# Altium project FPGA_breakout_board.PrjPcb
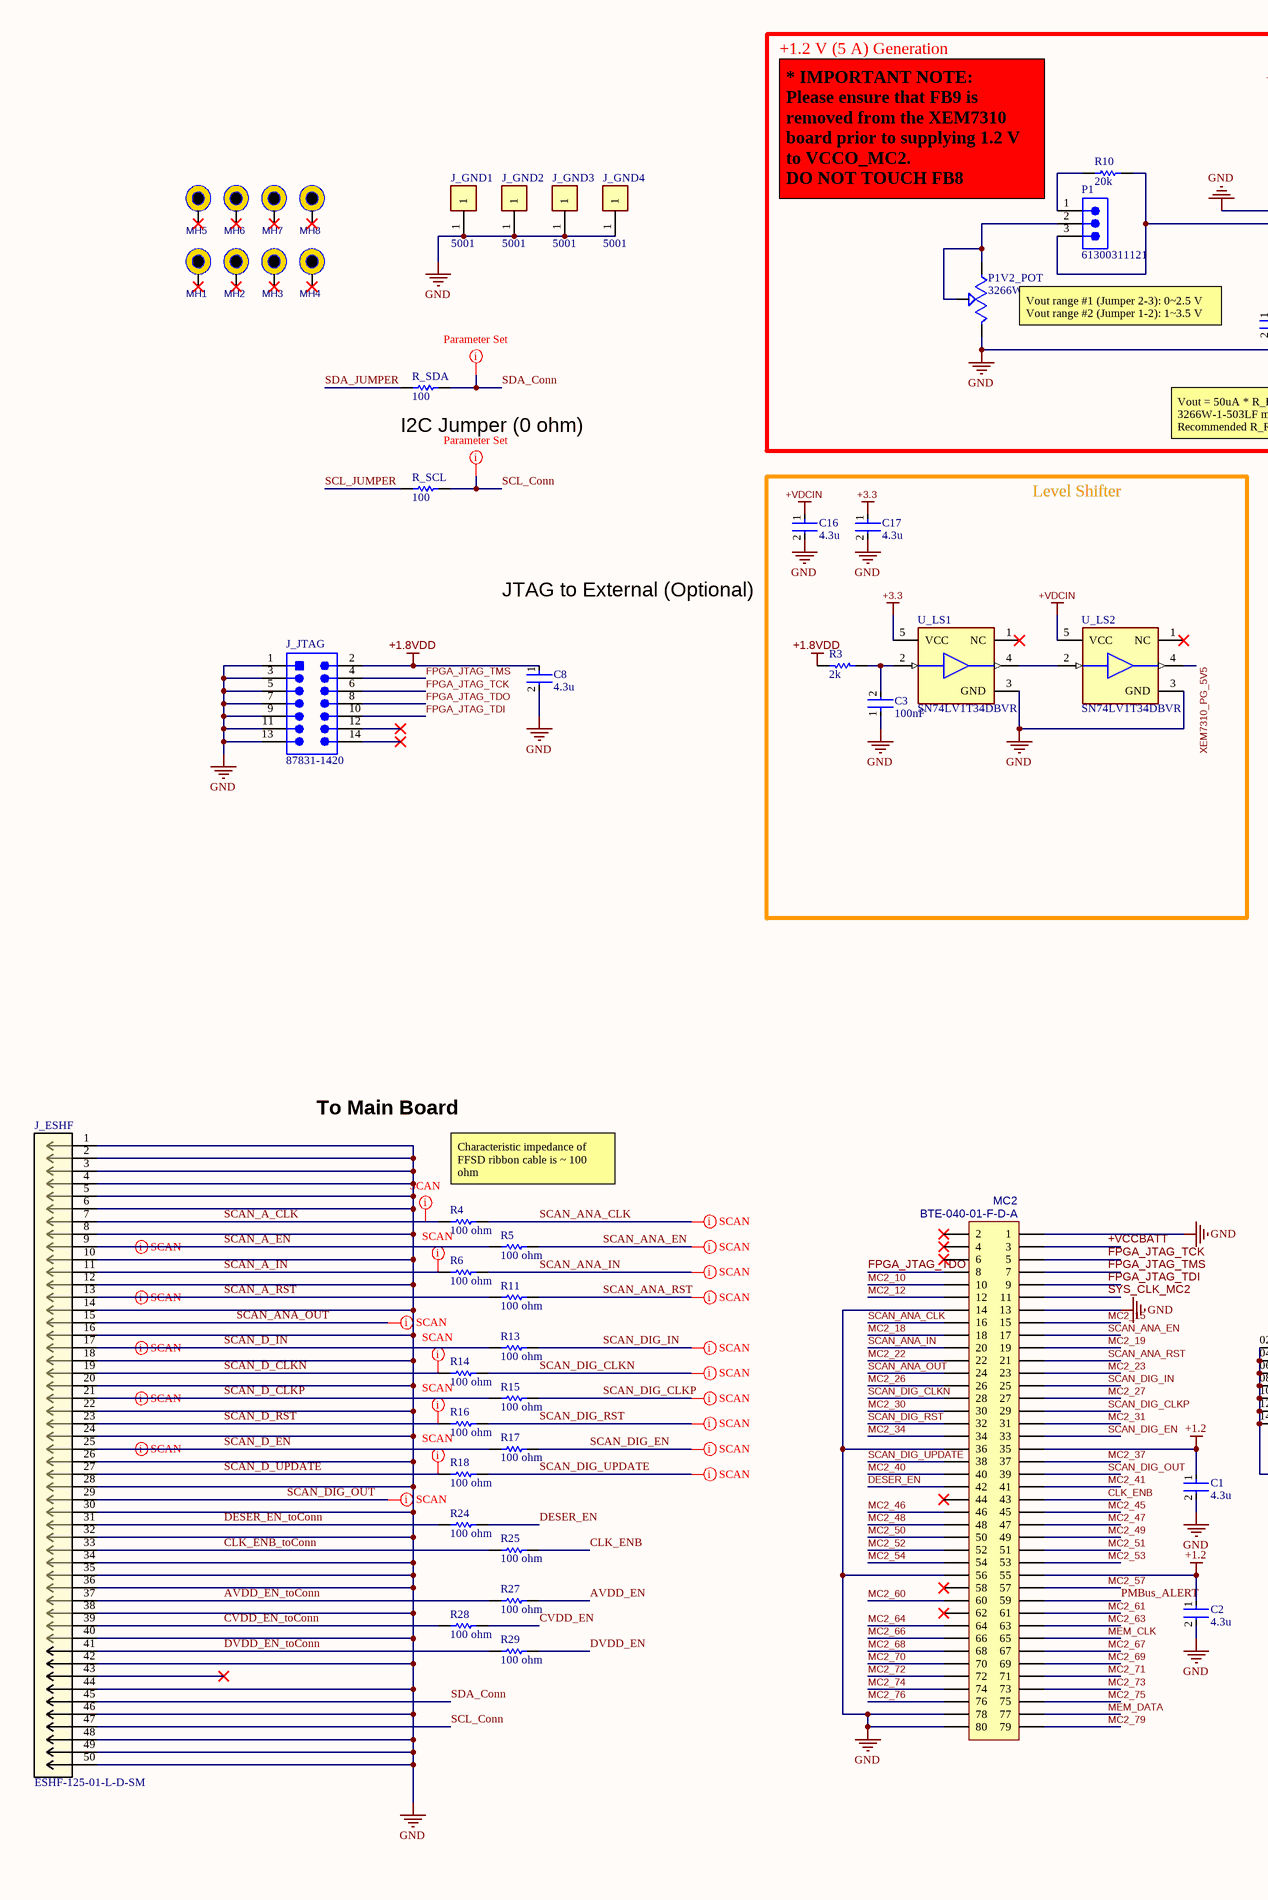
[diagram p0: BoardTop.SchDoc, left]
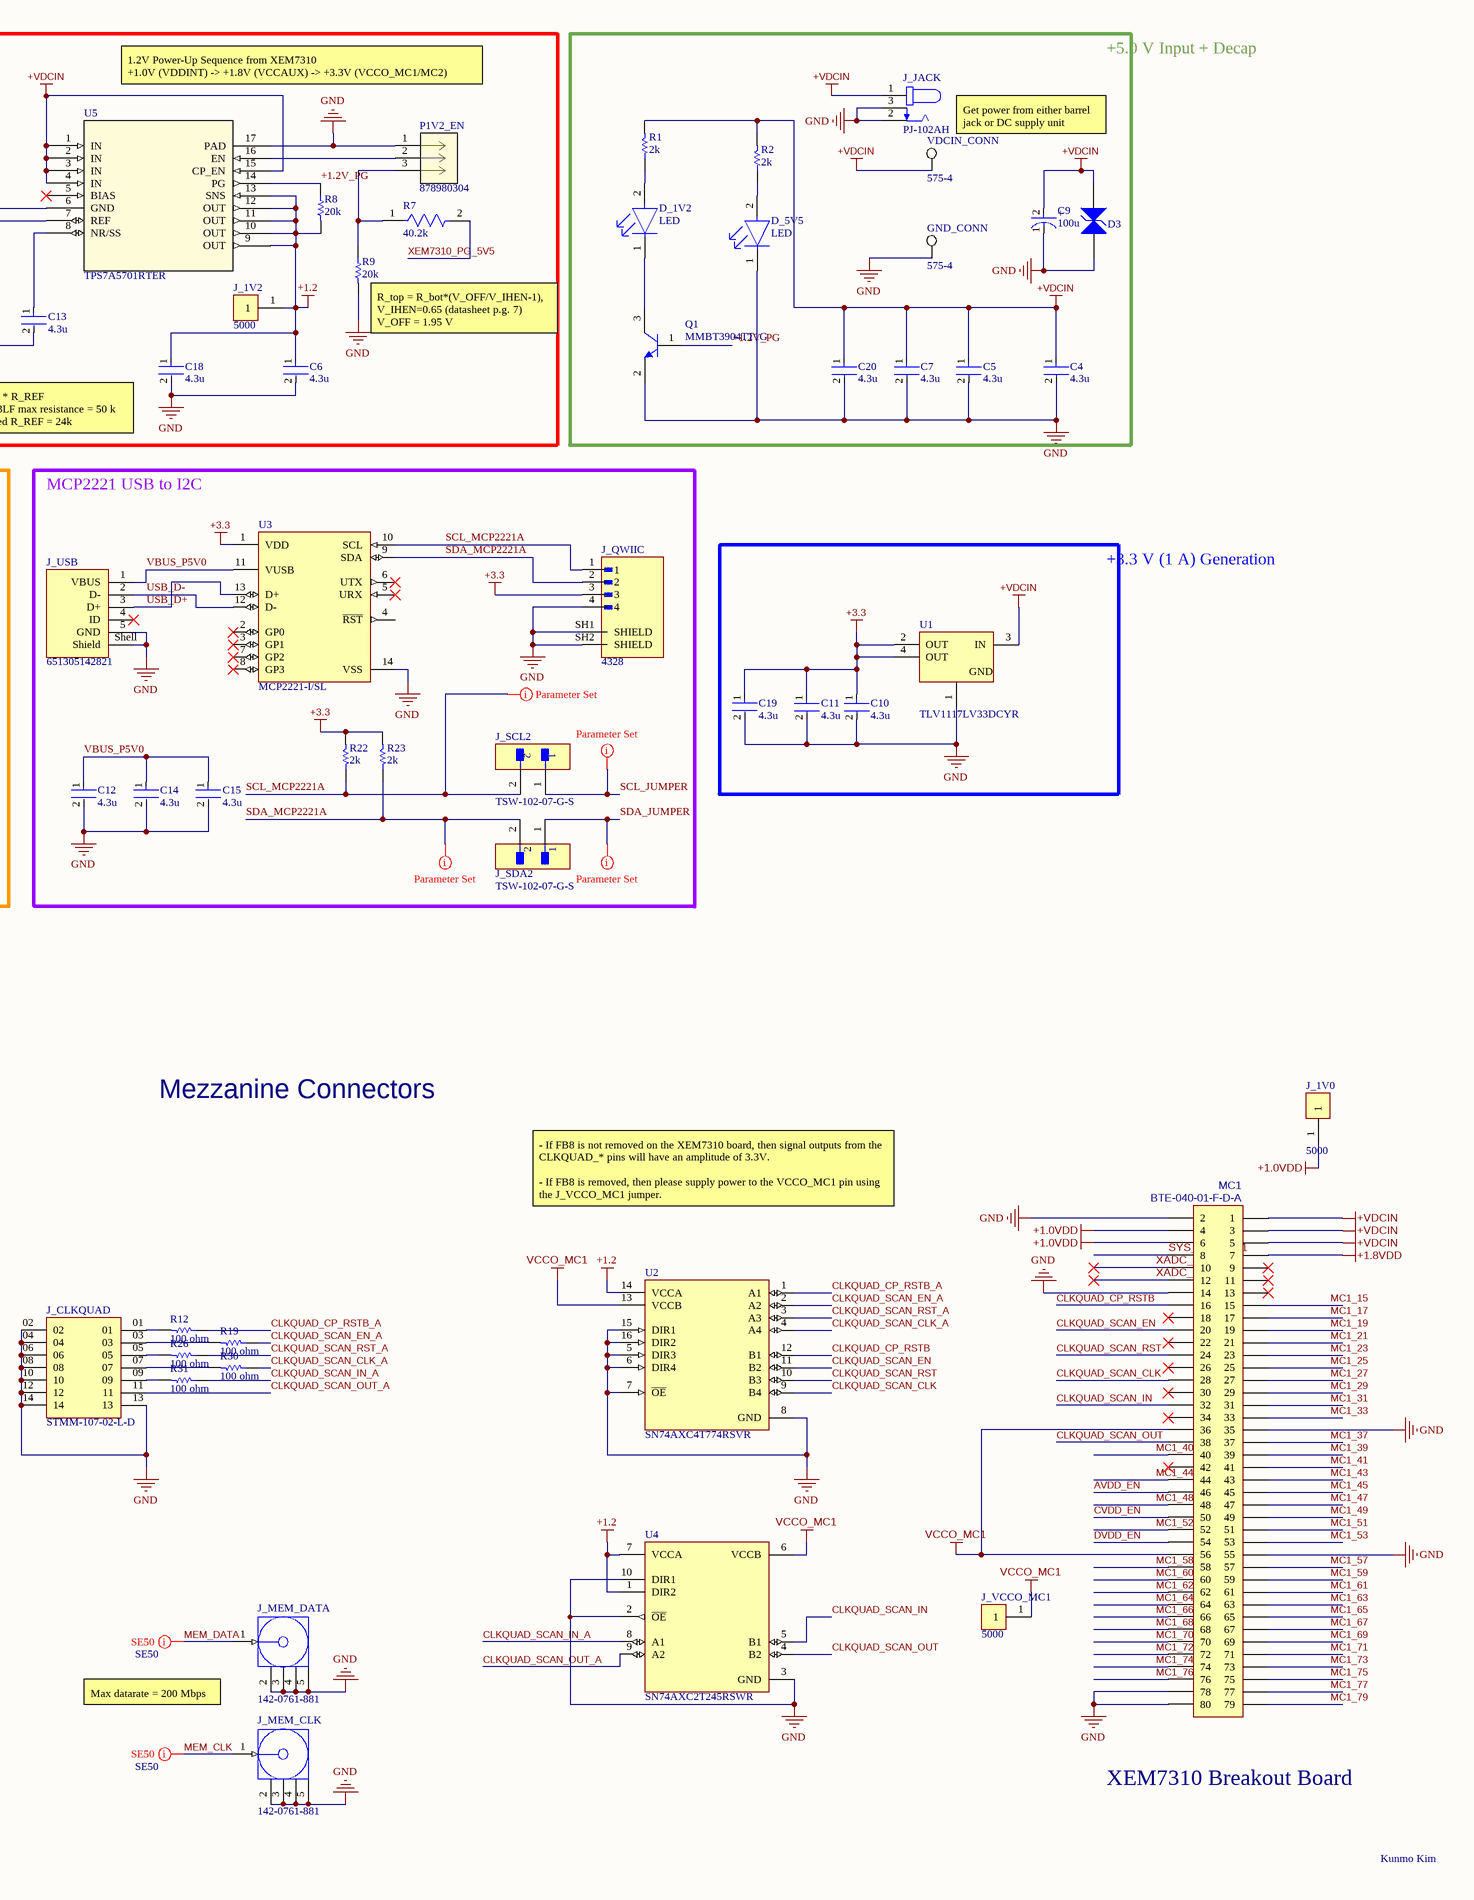
[diagram p1: BoardTop.SchDoc, right]
1 sheet, 94 parts. Net scope: global (net labels, ports and power ports of the same name join across sheets).
Board file: FPGA_breakout_board_v1.PcbDoc

## Sheet BoardTop.SchDoc
size A2; SheetNumber: 1; SheetTotal: 1

### Parts
C1  4.3u  [FP-LLL1U4-0_05-IPC_C]
C2  4.3u  [FP-LLL1U4-0_05-IPC_C]
C3  100nF  [FP-0603-L_1_6_0_15-W_0_81-MFG]
C4  4.3u  [FP-LLL1U4-0_05-IPC_C]
C5  4.3u  [FP-LLL1U4-0_05-IPC_C]
C6  4.3u  [FP-LLL1U4-0_05-IPC_C]
C7  4.3u  [FP-LLL1U4-0_05-IPC_C]
C8  4.3u  [FP-LLL1U4-0_05-IPC_C]
C9  100u  [FP-CX-MFG]
C10  4.3u  [FP-LLL1U4-0_05-IPC_C]
C11  4.3u  [FP-LLL1U4-0_05-IPC_C]
C12  4.3u  [FP-LLL1U4-0_05-IPC_C]
C13  4.3u  [FP-LLL1U4-0_05-IPC_C]
C14  4.3u  [FP-LLL1U4-0_05-IPC_C]
C15  4.3u  [FP-LLL1U4-0_05-IPC_C]
C16  4.3u  [FP-LLL1U4-0_05-IPC_C]
C17  4.3u  [FP-LLL1U4-0_05-IPC_C]
C18  4.3u  [FP-LLL1U4-0_05-IPC_C]
C19  4.3u  [FP-LLL1U4-0_05-IPC_C]
C20  4.3u  [FP-LLL1U4-0_05-IPC_C]
D3  SMAJ6.0CAHE3/5A  [VISH-DO-214AC-2_L]  (value not drawn)
D_1V2  LED  [FP-LTST-C190KGKT-MFG]
D_5V5  LED  [FP-LTST-C190KGKT-MFG]
GND_CONN  575-4  [KSTN-575-4]
J_1V0  5000  [FP-5000-MFG]
J_1V2  5000  [FP-5000-MFG]
J_CLKQUAD  STMM-107-02-L-D  [SAMTEC_STMM-107-02-L-D]
J_ESHF  ESHF-125-01-L-D-SM  [CONN_ESHF-125-01-x-D-SM_SAI]
J_GND1  5001  [FP-5001-MFG]
J_GND2  5001  [FP-5001-MFG]
J_GND3  5001  [FP-5001-MFG]
J_GND4  5001  [FP-5001-MFG]
J_JACK  PJ-102AH  [CUI_PJ-102AH]
J_JTAG  87831-1420  [MOLEX-87831-1420_V]
J_MEM_CLK  142-0761-881  [EMSN-142-0761-881-5_V]
J_MEM_DATA  142-0761-881  [EMSN-142-0761-881-5_V]
J_QWIIC  4328  [ADAFRUIT_4328]
J_SCL2  TSW-102-07-G-S  [FP-TSW-102-07-G-S-MFG]
J_SDA2  TSW-102-07-G-S  [FP-TSW-102-07-G-S-MFG]
J_USB  651305142821  [651305142821]
J_VCCO_MC1  5000  [FP-5000-MFG]
MC1  BTE-040-01-F-D-A  [BTE-040]
MC2  BTE-040-01-F-D-A  [BTE-040]
MH1  MTG  [MTG-3.2/6.5-PTH]  (value not drawn)
MH2  MTG  [MTG-3.2/6.5-PTH]  (value not drawn)
MH3  MTG  [MTG-3.2/6.5-PTH]  (value not drawn)
MH4  MTG  [MTG-3.2/6.5-PTH]  (value not drawn)
MH5  MTG  [MTG-3.2/6.5-PTH]  (value not drawn)
MH6  MTG  [MTG-3.2/6.5-PTH]  (value not drawn)
MH7  MTG  [MTG-3.2/6.5-PTH]  (value not drawn)
MH8  MTG  [MTG-3.2/6.5-PTH]  (value not drawn)
P1  61300311121  [61300311121]
P1V2_EN  878980304  [CONN03_87898_M-5p84_MOL]
P1V2_POT  3266W-1-503LF  [TRIM_3266W-1-503LF]
Q1  MMBT3904TT1G  [ONSC-SC-75-3-463-01_V]
R1  2k  [RESC3216X70X50NL05T20]
R2  2k  [RESC3216X70X50NL05T20]
R3  2k  [RESC3216X70X50NL05T20]
R4  100 ohm  [RESC1005X40X25ML05T05]
R5  100 ohm  [RESC1005X40X25ML05T05]
R6  100 ohm  [RESC1005X40X25ML05T05]
R7  40.2k  [FP-ERJ3EK-IPC_C]
R8  20k  [RESC1608X55X30ML15T15]
R9  20k  [RESC1608X55X30ML15T15]
R10  20k  [RESC1608X55X30ML15T15]
R11  100 ohm  [RESC1005X40X25ML05T05]
R12  100 ohm  [RESC1005X40X25ML05T05]
R13  100 ohm  [RESC1005X40X25ML05T05]
R14  100 ohm  [RESC1005X40X25ML05T05]
R15  100 ohm  [RESC1005X40X25ML05T05]
R16  100 ohm  [RESC1005X40X25ML05T05]
R17  100 ohm  [RESC1005X40X25ML05T05]
R18  100 ohm  [RESC1005X40X25ML05T05]
R19  100 ohm  [RESC1005X40X25ML05T05]
R22  2k  [RESC3216X70X50NL05T20]
R23  2k  [RESC3216X70X50NL05T20]
R24  100 ohm  [RESC1005X40X25ML05T05]
R25  100 ohm  [RESC1005X40X25ML05T05]
R26  100 ohm  [RESC1005X40X25ML05T05]
R27  100 ohm  [RESC1005X40X25ML05T05]
R28  100 ohm  [RESC1005X40X25ML05T05]
R29  100 ohm  [RESC1005X40X25ML05T05]
R30  100 ohm  [RESC1005X40X25ML05T05]
R31  100 ohm  [RESC1005X40X25ML05T05]
R_SCL  100  [RESC1608X55X30LL15T15]
R_SDA  100  [RESC1608X55X30LL15T15]
U1  TLV1117LV33DCYR  [DCY0004A_N]
U2  SN74AXC4T774RSVR  [FP-RSV0016A-MFG]
U3  MCP2221-I/SL  [FP-C04-065-SL-IPC_A]
U4  SN74AXC2T245RSWR  [FP-RSW0010A-MFG]
U5  TPS7A5701RTER  [WQFN16_RTE_TEX]
U_LS1  SN74LV1T34DBVR  [FP-DBV0005A-MFG]
U_LS2  SN74LV1T34DBVR  [FP-DBV0005A-MFG]
VDCIN_CONN  575-4  [KSTN-575-4]

### Blocks framed on the sheet
+1.2 V (5 A) Generation: C6 C13 C18 J_1V2 P1 P1V2_EN P1V2_POT R7-R10 U5
+5.0 V Input + Decap: C4 C5 C7 C9 C20 D3 D_1V2 D_5V5 GND_CONN J_JACK Q1 R1 R2 VDCIN_CONN
Level Shifter: C3 C16 C17 R3 U_LS1 U_LS2
MCP2221 USB to I2C: C12 C14 C15 J_QWIIC J_SCL2 J_SDA2 J_USB R22 R23 U3
+3.3 V (1 A) Generation: C10 C11 C19 U1

### Nets
+1.0VDD: J_1V0.1 MC1.4 MC1.6
+1.2: C1.1 C2.1 C6.1 C18.1 J_1V2.1 MC2.35 MC2.55 R8.2 U2.14(VCCA) U4.1(DIR2) U4.7(VCCA) U5.9(OUT) U5.10(OUT) U5.11(OUT) U5.12(OUT) U5.13(SNS)
+1.8VDD: C8.1 J_JTAG.2 MC1.7 R3.2
+3.3: C10.1 C11.1 C17.1 C19.1 J_QWIIC.3 R22.2 R23.2 U1.2(OUT) U1.4(OUT) U3.1(VDD) U_LS1.5(VCC)
+VDCIN: C4.1 C5.1 C7.1 C9.2(A) C16.1 C20.1 D3.1(A1) J_JACK.1 MC1.1 MC1.3 MC1.5 R1.2 R2.2 U1.3(IN) U5.1(IN) U5.2(IN) U5.3(IN) U5.4(IN) U5.15(CP_EN) U_LS2.5(VCC) VDCIN_CONN.1
GND: C1.2 C2.2 C3.1 C4.2 C5.2 C6.2 C7.2 C8.2 C9.1(C) C10.2 C11.2 C12.2 C13.2 C14.2 C15.2 C16.2 C17.2 C18.2 C19.2 C20.2 D3.2(A2) D_5V5.1(C) GND_CONN.1 J_CLKQUAD.02 J_CLKQUAD.04 J_CLKQUAD.06 J_CLKQUAD.08 J_CLKQUAD.10 J_CLKQUAD.12 J_CLKQUAD.13 J_CLKQUAD.14 J_ESHF.1 J_ESHF.2 J_ESHF.3 J_ESHF.4 J_ESHF.5 J_ESHF.6 J_ESHF.8 J_ESHF.10 J_ESHF.12 J_ESHF.14 J_ESHF.16 J_ESHF.18 J_ESHF.20 J_ESHF.22 J_ESHF.24 J_ESHF.26 J_ESHF.28 J_ESHF.30 J_ESHF.32 J_ESHF.34 J_ESHF.35 J_ESHF.36 J_ESHF.38 J_ESHF.40 J_ESHF.42 J_ESHF.44 J_ESHF.46 J_ESHF.48 J_ESHF.49 J_ESHF.50 J_GND1.1 J_GND2.1 J_GND3.1 J_GND4.1 J_JACK.2 J_JACK.3 J_JTAG.1 J_JTAG.3 J_JTAG.5 J_JTAG.7 J_JTAG.9 J_JTAG.11 J_JTAG.13 J_MEM_CLK.2(GND) J_MEM_CLK.3(GND) J_MEM_CLK.4(GND) J_MEM_CLK.5(GND) J_MEM_DATA.2(GND) J_MEM_DATA.3(GND) J_MEM_DATA.4(GND) J_MEM_DATA.5(GND) J_QWIIC.4 J_QWIIC.SH1(SHIELD) J_QWIIC.SH2(SHIELD) J_USB.5(GND) J_USB.Shell(Shield) MC1.2 MC1.14 MC1.35 MC1.55 MC1.78 MC1.80 MC2.1 MC2.13 MC2.14 MC2.36 MC2.56 MC2.78 MC2.80 P1V2_EN.1 P1V2_POT.3(CW) Q1.2(E) R9.2 U1.1(GND) U2.5(DIR3) U2.6(DIR4) U2.7(~{OE}) U2.8(GND) U2.15(DIR1) U2.16(DIR2) U3.14(VSS) U4.2(~{OE}) U4.3(GND) U4.10(DIR1) U5.6(GND) U5.17(PAD) U_LS1.3(GND) U_LS2.3(GND)
VCCO_MC1: J_VCCO_MC1.1 MC1.36 MC1.56 U2.13(VCCB) U4.6(VCCB)
+1.2V_PG: Q1.1(B) R8.1 U5.14(PG)
+VCCBATT: MC2.3
AVDD_EN: MC1.46 R27.2
AVDD_EN_toConn: J_ESHF.37 R27.1
CLK_ENB: MC2.43 R25.2
CLK_ENB_toConn: J_ESHF.33 R25.1
CLKQUAD_CP_RSTB: MC1.16 U2.12(B1)
CLKQUAD_CP_RSTB_A: R12.1 U2.1(A1)
CLKQUAD_SCAN_CLK: MC1.28 U2.9(B4)
CLKQUAD_SCAN_CLK_A: R30.1 U2.4(A4)
CLKQUAD_SCAN_EN: MC1.20 U2.11(B2)
CLKQUAD_SCAN_EN_A: R19.1 U2.2(A2)
CLKQUAD_SCAN_IN: MC1.32 U4.5(B1)
CLKQUAD_SCAN_IN_A: R31.1 U4.8(A1)
CLKQUAD_SCAN_OUT: MC1.38 U4.4(B2)
CLKQUAD_SCAN_OUT_A: J_CLKQUAD.11 U4.9(A2)
CLKQUAD_SCAN_RST: MC1.24 U2.10(B3)
CLKQUAD_SCAN_RST_A: R26.1 U2.3(A3)
CVDD_EN: MC1.50 R28.2
CVDD_EN_toConn: J_ESHF.39 R28.1
DESER_EN: MC2.42 R24.2
DESER_EN_toConn: J_ESHF.31 R24.1
DVDD_EN: MC1.54 R29.2
DVDD_EN_toConn: J_ESHF.41 R29.1
FPGA_JTAG_TCK: J_JTAG.6 MC2.5
FPGA_JTAG_TDI: J_JTAG.10 MC2.9
FPGA_JTAG_TDO: J_JTAG.8 MC2.8
FPGA_JTAG_TMS: J_JTAG.4 MC2.7
MC1_15: MC1.15
MC1_17: MC1.17
MC1_19: MC1.19
MC1_21: MC1.21
MC1_23: MC1.23
MC1_25: MC1.25
MC1_27: MC1.27
MC1_29: MC1.29
MC1_31: MC1.31
MC1_33: MC1.33
MC1_37: MC1.37
MC1_39: MC1.39
MC1_40: MC1.40
MC1_41: MC1.41
MC1_43: MC1.43
MC1_44: MC1.44
MC1_45: MC1.45
MC1_47: MC1.47
MC1_48: MC1.48
MC1_49: MC1.49
MC1_51: MC1.51
MC1_52: MC1.52
MC1_53: MC1.53
MC1_57: MC1.57
MC1_58: MC1.58
MC1_59: MC1.59
MC1_60: MC1.60
MC1_61: MC1.61
MC1_62: MC1.62
MC1_63: MC1.63
MC1_64: MC1.64
MC1_65: MC1.65
MC1_66: MC1.66
MC1_67: MC1.67
MC1_68: MC1.68
MC1_69: MC1.69
MC1_70: MC1.70
MC1_71: MC1.71
MC1_72: MC1.72
MC1_73: MC1.73
MC1_74: MC1.74
MC1_75: MC1.75
MC1_76: MC1.76
MC1_77: MC1.77
MC1_79: MC1.79
MC2_10: MC2.10
MC2_12: MC2.12
MC2_15: MC2.15
MC2_18: MC2.18
MC2_19: MC2.19
MC2_22: MC2.22
MC2_23: MC2.23
MC2_26: MC2.26
MC2_27: MC2.27
MC2_30: MC2.30
MC2_31: MC2.31
MC2_34: MC2.34
MC2_37: MC2.37
MC2_40: MC2.40
MC2_41: MC2.41
MC2_45: MC2.45
MC2_46: MC2.46
MC2_47: MC2.47
MC2_48: MC2.48
MC2_49: MC2.49
MC2_50: MC2.50
MC2_51: MC2.51
MC2_52: MC2.52
MC2_53: MC2.53
MC2_54: MC2.54
MC2_57: MC2.57
MC2_60: MC2.60
MC2_61: MC2.61
MC2_63: MC2.63
MC2_64: MC2.64
MC2_66: MC2.66
MC2_67: MC2.67
MC2_68: MC2.68
MC2_69: MC2.69
MC2_70: MC2.70
MC2_71: MC2.71
MC2_72: MC2.72
MC2_73: MC2.73
MC2_74: MC2.74
MC2_75: MC2.75
MC2_76: MC2.76
MC2_79: MC2.79
MEM_CLK: J_MEM_CLK.1(Signal) MC2.65
MEM_DATA: J_MEM_DATA.1(Signal) MC2.77
PMBus_ALERT: MC2.59
SCAN_A_CLK: J_ESHF.7 R4.1
SCAN_A_EN: J_ESHF.9 R5.1
SCAN_A_IN: J_ESHF.11 R6.1
SCAN_A_RST: J_ESHF.13 R11.1
SCAN_ANA_CLK: MC2.16 R4.2
SCAN_ANA_EN: MC2.17 R5.2
SCAN_ANA_IN: MC2.20 R6.2
SCAN_ANA_OUT: J_ESHF.15 MC2.24
SCAN_ANA_RST: MC2.21 R11.2
SCAN_D_CLKN: J_ESHF.19 R14.1
SCAN_D_CLKP: J_ESHF.21 R15.1
SCAN_D_EN: J_ESHF.25 R17.1
SCAN_D_IN: J_ESHF.17 R13.1
SCAN_D_RST: J_ESHF.23 R16.1
SCAN_D_UPDATE: J_ESHF.27 R18.1
SCAN_DIG_CLKN: MC2.28 R14.2
SCAN_DIG_CLKP: MC2.29 R15.2
SCAN_DIG_EN: MC2.33 R17.2
SCAN_DIG_IN: MC2.25 R13.2
SCAN_DIG_OUT: J_ESHF.29 MC2.39
SCAN_DIG_RST: MC2.32 R16.2
SCAN_DIG_UPDATE: MC2.38 R18.2
SCL_Conn: J_ESHF.47 R_SCL.2
SCL_JUMPER: J_SCL2.1 R_SCL.1
SCL_MCP2221A: J_QWIIC.1 J_SCL2.2 R22.1 U3.10(SCL)
SDA_Conn: J_ESHF.45 R_SDA.2
SDA_JUMPER: J_SDA2.1 R_SDA.1
SDA_MCP2221A: J_QWIIC.2 J_SDA2.2 R23.1 U3.9(SDA)
SYS_CLK_MC1: MC1.8
SYS_CLK_MC2: MC2.11
USB_D+: J_USB.3(D+) U3.13(D+)
USB_D-: J_USB.2(D-) U3.12(D-)
VBUS_P5V0: C12.1 C14.1 C15.1 J_USB.1(VBUS) U3.11(VUSB)
XADC_VN_FILT: MC1.10
XADC_VP_FILT: MC1.12
XEM7310_PG_5V5: R7.2 U_LS2.4(Y)
NetC3_2: C3.2 R3.1 U_LS1.2(A)
NetC13_1: C13.1 U5.8(NR/SS)
NetD_1V2_1: D_1V2.1(C) Q1.3(C)
NetD_1V2_2: D_1V2.2(A) R1.1
NetD_5V5_2: D_5V5.2(A) R2.1
NetJ_CLKQUAD_01: J_CLKQUAD.01 R12.2
NetJ_CLKQUAD_03: J_CLKQUAD.03 R19.2
NetJ_CLKQUAD_05: J_CLKQUAD.05 R26.2
NetJ_CLKQUAD_07: J_CLKQUAD.07 R30.2
NetJ_CLKQUAD_09: J_CLKQUAD.09 R31.2
NetP1_1: P1.1 R10.1
NetP1_2: P1.2 P1V2_POT.1(CCW) P1V2_POT.2(WIPER)
NetP1_3: P1.3 R10.2 U5.7(REF)
NetP1V2_EN_2: P1V2_EN.2 U5.16(EN)
NetP1V2_EN_3: P1V2_EN.3 R7.1 R9.1
NetU_LS1_4: U_LS1.4(Y) U_LS2.2(A)

Not connected (* = marked no-connect by the designer): J_ESHF 43*; J_JTAG 12* 14*; J_USB 4(ID)*; MC1 9* 11* 13* 18* 22* 26* 30* 34* 42*; MC2 2* 4* 6* 44* 58* 62*; MH1 1*; MH2 1*; MH3 1*; MH4 1*; MH5 1*; MH6 1*; MH7 1*; MH8 1*; U3 2(GP0)* 3(GP1)* 4(~{RST}) 5(URX)* 6(UTX)* 7(GP2)* 8(GP3)*; U5 5(BIAS)*; U_LS1 1(NC)*; U_LS2 1(NC)*

### Layout directives
net class SE50: MEM_CLK, MEM_DATA
net class SCAN: SCAN_A_CLK, SCAN_A_EN, SCAN_A_IN, SCAN_A_RST, SCAN_ANA_CLK, SCAN_ANA_EN, SCAN_ANA_IN, SCAN_ANA_OUT, SCAN_ANA_RST, SCAN_D_CLKN, SCAN_D_CLKP, SCAN_D_EN, SCAN_D_IN, SCAN_D_RST, SCAN_D_UPDATE, SCAN_DIG_CLKN, SCAN_DIG_CLKP, SCAN_DIG_EN, SCAN_DIG_IN, SCAN_DIG_OUT, SCAN_DIG_RST, SCAN_DIG_UPDATE
net class I2C: SCL_Conn, SCL_JUMPER, SCL_MCP2221A, SDA_Conn, SDA_JUMPER, SDA_MCP2221A

### Notes on the sheet
- 1.2V Power-Up Sequence from XEM7310
  +1.0V (VDDINT) -> +1.8V (VCCAUX) -> +3.3V (VCCO_MC1/MC2)
- Get power from either barrel jack or DC supply unit
- * IMPORTANT NOTE:
  Please ensure that FB9 is removed from the XEM7310 board prior to supplying 1.2 V to VCCO_MC2.
  DO NOT TOUCH FB8
- Vout range #1 (Jumper 2-3): 0~2.5 V
  Vout range #2 (Jumper 1-2): 1~3.5 V
- (near R9) R_top = R_bot*(V_OFF/V_IHEN-1), V_IHEN=0.65 (datasheet p.g. 7)
  V_OFF = 1.95 V
- (near R_SDA) I2C Jumper (0 ohm)
- Vout = 50uA * R_REF
  3266W-1-503LF max resistance = 50 k
  Recommended R_REF = 24k
- JTAG to External (Optional)
- To Main Board
- Mezzanine Connectors
- (near R4) Characteristic impedance of FFSD ribbon cable is ~ 100 ohm
- - If FB8 is not removed on the XEM7310 board, then signal outputs from the CLKQUAD_* pins will have an amplitude of 3.3V.
  - If FB8 is removed, then please supply power to the VCCO_MC1 pin using the J_VCCO_MC1 jumper.
- Max datarate = 200 Mbps
- XEM7310 Breakout Board
- Kunmo Kim
- (in symbol CMP-05427-000056-1) +

### Library data of the parts
C1 C2 C4-C8 C10-C20 = CMP-06035-061933-1: Cap Ceramic Monolithic 4.3uF 20% 4V X5R 15% 02404 (0610M); Capacitance: 4.3uF; Tolerance: 20%; Min Operating Temperature: -55°C; Case/Package: 0204; Voltage Rating: 4V; Mount: Surface Mount; Max Operating Temperature: 85°C; Packaging: Tape and Reel; RoHS Compliant: Yes
C3 = CMP-1035-02592-4: General Purpose Ceramic Capacitor, 0603, 100nF, 10%, X7R, 15%, 50V; Dissipation Factor: 2.5%; Radiation Hardening: No; Termination: SMD/SMT; Tolerance: 10%; Lead Free: Lead Free; Width: 0.81mm; Max Operating Temperature: 125°C; Thickness: 0.035inch; Voltage Rating: 50V; Height: 0.9mm; Case/Package: 0603; Depth: 0.81mm; Number of Pins: 2; Capacitance: 100nF; REACH SVHC: No SVHC; Case Code (Imperial): 0603; Voltage: 50V; Voltage Rating (DC): 50V; Mount: Surface Mount; Length: 1.6mm; Min Operating Temperature: -55°C; Packaging: Tape and Reel; Case Code (Metric): 1608; Dielectric Material: Ceramic; Package Quantity: 1; Dielectric: X7R; Contact Plating: Tin
C9 = CMP-05427-000056-1: CAP ALUM POLY 100UF 20% 6.3V SMD; Leakage Current: 63uA; Polarity: Polar; Lead Diameter: 2.4mm; Dissipation Factor: 0.06%; Ripple Current: 2.7A; ESR (Equivalent Series Resistance): 15mR; Life (Hours): 1000Hour; Voltage Rating: 6.3V; Case/Package: 2917; Lead Pitch: 1.3mm; Series: SP-Cap CX; Weight: 0.004586oz; Radiation Hardening: No; Case Code (Imperial): 2917; Length: 7.3mm; Number of Pins: 2; Lead Free: Lead Free; REACH SVHC: No SVHC; Max Operating Temperature: 105°C; Package Quantity: 3500; Packaging: Tape and Reel; Height - Seated (Max): 0.075inch; Mount: Surface Mount; Height: 1.9mm; Termination: SMD/SMT; Voltage: 6.3V; Construction: Flat; Width: 0.169inch; Ripple Current (AC): 2.7A; Capacitance: 100uF; Voltage Rating (DC): 6.3V; Case Code (Metric): 7343; Min Operating Temperature: -40°C; Tolerance: 20%; RoHS Compliant: Yes; Depth: 4.3mm
D3 = CMP-0548-00108-2: Transient Voltage Suppressor, 6.40 to 231 V, 6 V Stand-off Voltage, Bi-Directional, -55 to 155 degC, 2-pin DO-214AC, Pb-Free, Tape and Reel; Manufacturer: Vishay Semiconductor; VBR Bi-Directional (V): 6.4 to 231; VWM (V): 6; IFSM: 40 A; ID (uA): 1600; PPPM (W): 400, 300; PackageDescription: 2-Pin DO-214AC (SMA), Body 4.245 x 2.665 mm; Packing: Tape and Reel; RoHS: TRUE; ComponentLink3Description: Package Specification; ComponentLink2Description: Datasheet; Mounting Technology: Surface Mount; Operating Junction and Storage Temperature Range: -55 to 150 degC; ComponentLink2URL: http://www.vishay.com/docs/88390/smaj50a.pdf; ComponentLink1Description: Manufacturer URL; DatasheetVersion: 12/8/2013; PackageReference: DO-214AC-2; ComponentLink3URL: http://www.vishay.com/docs/88390/smaj50a.pdf; PartNumber: SMAJ6.0CAHE3/5A; ComponentLink1URL: http://www.vishay.com/; Supplier 1: Mouser; Supplier Part Number 1: 78-SMAJ6.0CAHE3_A/H
D_1V2 D_5V5 = CMP-2000-05197-2: LED GREEN CLEAR CHIP SMD; Test Current: 20mA; Power Rating: 75mW; Forward Voltage: 2V; Wavelength: 574nm; Number of LEDs: 1; Reverse Voltage: 5V; Dominant Wavelength: 571nm; Lens Style: Diffused; Luminous Intensity: 35mcd; Forward Current: 30mA; Viewing Angle: 130°; Lens Color: Colorless; Width: 0.8mm; Case Code (Imperial): 0603; Case Code (Metric): 1608; Number of Pins: 2; Radiation Hardening: No; Package Quantity: 1; Lead Free: Lead Free; Lens Transparency: Clear; Depth: 0.8mm; Power Dissipation: 75mW; Mount: Surface Mount; Max Operating Temperature: 85°C; Case/Package: 0603; Height: 0.8mm; Illumination Color: Green; Color: Green; Length: 1.6mm; Packaging: Tape and Reel; Number of Elements: 1; Min Operating Temperature: -55°C
GND_CONN VDCIN_CONN = CMP-2000-05649-1: Banana Jack, Non-Insulated, 1-Pin THD, RoHS, Bulk; Manufacturer: Keystone-Electronics; Package Version: Rev. B, 11/1994; Plug/Mating Plug Diameter: StandardBanana; Gender: Female; Package Reference: 575-4; Operating Temperature: -; Contact Material: Brass; Packaging: Bulk; Series: -; Category: Connectors,Interconnects; Color: -; Type: BananaJack; Contact Finish: Nickel; Features: -; Family: BananaandTipConnectors-Jacks,Plugs; Body Material: -; Manufacturer URL: http://www.keyelco.com/; Termination: Solder; Insulation: Non-Insulated; Datasheet Version: Rev. B, 11/1994; Mounting Technology: ThroughHole; Package URL: http://www.keyelco.com/product-pdf.cfm?p=2379; Mounting Type: ThroughHole; Package Description: 1-Pin Through Hole Device, Dia 7.92 mm; Datasheet URL: http://www.keyelco.com/product-pdf.cfm?p=2379; Wire Gauge: -; ClassName: InputPowerComponent
J_1V0 J_1V2 J_VCCO_MC1 = CMP-19636-000027-1: PC TEST POINT MINIATURE RED; Outside Diameter: 2.54mm; Body Material: Bronze; Number of Contacts: 1; Insulation: Insulated; Inside Diameter: 1.27mm; Hole Diameter: 1.6mm; Plating: Silver; Length: 7.62mm; Package Quantity: 100; Number of Ports: 1; Contact Material: Bronze; Orientation: Straight; RoHS Compliant: Yes; Housing Color: Red; Height: 0.3inch; Series: THM; Lead Free: Lead Free; Color: Red; Contact Plating: Tin; Mount: PCB; Packaging: Bulk; REACH SVHC: No SVHC; Flammability Rating: UL94 V-0; Material: Nylon
J_CLKQUAD = STMM-107-02-L-D: Connector Header Surface Mount 14 position 0.079 (2.00mm); MF: Samtec; MP: STMM-107-02-L-D; SnapEDA_Link: https://www.snapeda.com/parts/STMM-107-02-L-D/Samtec/view-part/3409678/?ref=snap; Package: None; Value: *; Digi-Key_Part_Number: STMM-107-02-L-D-SM-TR-ND; Supplier 1: Mouser; Supplier Part Number 1: 200-STMM10702LD; Check_prices: https://www.snapeda.com/parts/STMM-107-02-L-D/Samtec/view-part/3409678/?ref=eda; ClassName: InputPowerComponent
J_ESHF = ESHF-125-01-L-D-SM: No Description Available; Mfr_Name: Samtec Inc; Type: Headers, Male Pins; RefDes: RefDes; ClassName: InputPowerComponent; Supplier 1: Digikey; Supplier Part Number 1: SAM15560-ND
J_GND1-J_GND4 = CMP-2000-05181-2: PC TEST POINT MINIATURE BLACK; Body Material: Bronze; Plating: Silver; Inside Diameter: 1.27mm; Hole Diameter: 1.6mm; Number of Ports: 1; Outside Diameter: 2.54mm; Insulation: Insulated; Insulation Material: Nylon; Mount: Through Hole; RoHS Compliant: Yes; Series: THM; Height: 0.3inch; Termination: Through Hole; Material: Nylon; Packaging: Bulk; Contact Material: Bronze; REACH SVHC: No SVHC; Contact Plating: Silver; Orientation: Straight; Lead Free: Lead Free; Package Quantity: 100; Length: 7.62mm; Flammability Rating: UL94 V-0; Number of Contacts: 1; Diameter: 2.54mm; Housing Color: Black; Color: Black
J_JACK = PJ-102AH: 2.0 x 6.5 mm, 5.0 A, Horizontal, Through Hole, Tapered Pins, Dc Power Jack Connector; MF: Same Sky; SnapEDA_Link: https://www.snapeda.com/parts/PJ-102AH/Same+Sky/view-part/?ref=snap; Package: None; Value: *; MP: PJ-102AH; Check_prices: https://www.snapeda.com/parts/PJ-102AH/Same+Sky/view-part/?ref=eda; ClassName: InputPowerComponent
J_JTAG = CMP-2000-05240-1: Header, Pitch 2 mm, 2 x 7 Position, Height 6.4 mm, Tail Length 2.5 mm, -55 to 105 degC, RoHS, Tube; Number of Positions / Contacts: 14; Current Rating: 2A; Brand: Molex; Mounting Angle: Vertical; Pitch: 2mm; Voltage Rating: 125V; Datasheet Version: Rev. E, 04/2006; Housing Material: Thermoplastic; Contact Material: Brass; Datasheet URL: https://datasheet.ciiva.com/27096/1934585-27096088.pdf; Type: Shrouded; Number of Positions: 14; Mounting Style: ThroughHole; Product Category: Headers&WireHousings; RoHS: Details; Factory Pack Quantity: 3200; Contact Plating: Gold; Series: 87831; Number of Rows: 2; Manufacturer: Molex; Product Type: Headers; Termination Style: ThroughHole; Packaging: Tube; Tradename: Milli-Grid; Manufacturer URL: http://www.molex.com/; ClassName: InputPowerComponent
J_MEM_CLK J_MEM_DATA = CMP-0839-00001-1: SMA High Freq End Launch Jack Receptacle, PCB Mount, 10 MIL Pin, 26.5 GHz, 50 Ohm, -65 to 165 degC, Round Body Radius 6.27 mm, Body Length 9.52 mm, RoHS; Manufacturer: Emerson Network Power; Body Meaterial: Brass; Impedance: 50 Ohm; Body Plating: Gold; DatasheetVersion: Rev. 0; ComponentLink3URL: https://emersonconnectivity.com/OA_MEDIA/drawings/dr-142-0761-881.pdf; Operating Temperature: -65 to 165 degC; RoHS: TRUE; ComponentLink1URL: https://emersonconnectivity.com/; Mounting Technology: Through Hole; PackageVersion: Rev. 0; PartNumber: 142-0761-881; Termination Type: Solder; Termination Style: Printed Circuit Board; PackageDescription: Jack Receptacle - PC Mount, Body Radius 6.27 mm, Body Length 9.52 mm; Mouting Style: End Launch; PackageReference: 142-0761-881-5; Gender: Jack; Max Frequency: 26.5 GHz; ComponentLink2URL: http://emersonconnectivity.com/OA_MEDIA/drawings/dr-142-0761-881.pdf; ComponentLink3Description: Package Specification; ComponentLink2Description: Datasheet; ComponentLink1Description: Manufacturer URL; Contact Plating: Gold; Series: SMA HF
J_QWIIC = 4328: Adafruit Accessories JST SH 4-pin Vertical Connector (10-pack) - Qwiic Compatible; SnapEDA_Link: https://www.snapeda.com/parts/4328/Adafruit+Industries/view-part/?ref=snap; Package: None; Value: *; MF: Adafruit; MP: 4328; Check_prices: https://www.snapeda.com/parts/4328/Adafruit+Industries/view-part/?ref=eda
J_SCL2 J_SDA2 = CMP-02766-000084-1: CONN HEADER VERT 2POS 2.54MM; Manufacturer: Samtec; Number Of Contacts: 2; Voltage Rating: 550V; Conn Orientation: Straight; Current Rating: 6.3A; Conn Gender: Male; Package: TSW-102-07-G-S; Digikey Description: CONN HEADER VERT 2POS 2.54MM; ComponentLink2URL: http://suddendocs.samtec.com/catalog_english/tsw_th.pdf; Height: 8.71mm; Temperature: -55°C to +125°C; Device Class L2: Headers and Wire Housings; ComponentLink2Description: Datasheet; Device Class L3: unset; Contact Material: Gold,Nickel; Temperature Range Low: -55°C; Temperature Range High: +125°C; RoHS: TRUE; Device Class L1: Connectors; Mouser Description: Conn Unshrouded Header HDR 2 POS 2.54mm Solder ST Thru-Hole Automotive Bulk; Number Of Rows: 1; Category: Conn; Pitch: 2.54mm; Lead Free: Yes; Automotive: No; Manufacturer Part Number: TSW-102-07-G-S; Footprint Url: http://suddendocs.samtec.com/prints/tsw-xxx-xx-x-x-xx-xxx-footprint.pdf; Octopart: https://octopart.com/tsw-102-07-g-s-samtec-272197
J_USB = CMP-1502-03247-2: NexarPartId: 19991175; Operating Supply Voltage: 30V; Current Rating: 1A; Contact Resistance: 20mΩ; Connector Type: USB; Number of Contacts: 5; USB Standard: USB 2.0; Gender: Receptacle; Insulation Resistance: 1GΩ; REACH SVHC: Unknown; Contact Plating: Gold; Min Operating Temperature: -40°C; Features: Shielded; RoHS: Compliant; Contact Material: Copper; Packaging: Tape and Reel; Termination: SMD/SMT; Max Operating Temperature: 105°C; Orientation: Horizontal; Number of Pins: 5; Mount: Horizontal, Surface Mount; Lead Free: Lead Free
MC1 MC2 = BTE040: 0.8mm high-density header; Manufacturer: Samtec; partnumber: 000059; Description 2: 80-pin, Gold flash, Mated height: 5.00mm (0.197 inch); Manufacturer_PN: BTE-040-01-F-D-A; updated_on: 1/18/2016 3:47:24 PM; Supplier 1: Digikey; Supplier Part Number 1: SAM9060-ND
MH1-MH8 = MTG: Mounting hole
P1 = CMP-1502-01062-3: NexarPartId: 32855521; Current Rating: 3A; Voltage Rating: 250V; Number of Positions: 3; Pitch: 2.54mm; Contact Resistance: 20mΩ; Connector Type: Male Pin; Gender: Male; REACH SVHC: Unknown; Packaging: Bulk; Contact Material: Copper; Min Operating Temperature: -40°C; Number of Rows: 1; Orientation: Vertical; RoHS: Compliant; Contact Plating: Gold; Max Operating Temperature: 105°C; Mount: Through Hole; Height: 8.94mm; Operating Supply Voltage: 250V; Number of Pins: 3; Contact Mating Length: 5.9944mm; Number of Contacts: 3; Color: Black; Lead Free: Lead Free; Lead Pitch: 2.54mm; Termination: Solder
P1V2_EN = 878980304: No Description Available; Mfr_Name: Molex Connector Corporation; RefDes: RefDes; Type: Type
P1V2_POT = 3266W-1-503LF: 50 kOhms 0.25W, 1/4W PC Pins Through Hole Trimmer Potentiometer Cermet 12 Turn Top Adjustment; MF: Bourns; SnapEDA_Link: https://www.snapeda.com/parts/3266W-1-503LF/Bourns/view-part/289740/?ref=snap; MP: 3266W-1-503LF; Availability: Good; Price: None; Check_prices: https://www.snapeda.com/parts/3266W-1-503LF/Bourns/view-part/289740/?ref=eda; Value: *; Purchase-URL: https://pricing.snapeda.com/search/part/3266W-1-503LF/?ref=eda; Package: TO-218 Bourns; ClassName: InputPowerComponent
Q1 = CMP-1048-00420-1: General Purpose Transistor, NPN Silicon, 3-Pin SC-75, Pb-Free, Tape and Reel; Manufacturer: On Semiconductor; IC Continuous (A): 0.2; fT Min (MHz): 300; ComponentLink3URL: http://www.onsemi.com/pub_link/Collateral/463-01.PDF; DatasheetVersion: Rev. 5; RoHS: TRUE; Mounting Technology: Surface Mount; ComponentLink1URL: http://www.onsemi.com/; ComponentLink3Description: Package Specification; PackageReference: SC-75-3-463-01; Polarity: NPN; ComponentLink2Description: Datasheet; PackageVersion: Rev. F, 07/2005; PartNumber: MMBT3904TT1G; ComponentLink2URL: http://www.onsemi.cn/pub_link/Collateral/MMBT3904TT1-D.PDF; ComponentLink1Description: Manufacturer URL; PackageDescription: 3-Pin Small Outline Transistor, Body 1.6 x 0.8 mm, Pitch 0.5 mm; Packing: Tape and Reel
R1-R3 R22 R23 = CMP-2003-00195-1: Part Number: ERJ-8ENF2001V; Manufacturer: Panasonic
R4-R6 R11-R19 R24-R31 = CMP-2002-00605-3: Chip Resistor, 100 Ohm, +/- 1%, 100 mW, -55 to 155 degC, 0402 (1005 Metric), RoHS, Tape and Reel; Manufacturer: Basic Passives; PartNumber: ERJ-2RKF1000X; Power Rating: 100 mW; Voltage Rating: 50 V; Case\/Package: 0402; Width: 0.5 mm; Pins: 2; ComponentLink2Description: Datasheet; PackageReference: 0402; Height: 0.35 mm; Tolerance: 1%; DatasheetVersion: 04/2015; Case Code (Imperial): 0402; Min Operating Temperature: -55 degC; Radiation Hardening: No; Length: 1 mm; Package Quantity: 10000; PackageDescription: 2-Pin Surface Mount Device, Body 1 x 0.5 mm; Mounting Technology: Surface Mount; Case Code (Metric): 1005; Packaging: Tape and Reel; ComponentLink1URL: http://www.panasonic.com/; RoHSCompliant: true; Max Operating Temperature: 155 degC; REACH SVHC: Yes; ComponentLink1Description: Manufacturer URL; Resistance: 100 Ohm; ComponentLink2URL: http://industrial.panasonic.com/cdbs/www-data/pdf/RDA0000/AOA0000C86.pdf; Mount: Surface Mount
R7 = CMP-2000-00486-2: RES SMD 40.2K OHM 1% 1/10W 0603; Power Rating: 100mW; Resistance: 40.2kR; Voltage Rating: 75V; Temperature Coefficient: 100ppm/°C; Voltage Rating (DC): 50V; Military Standard: Not; Lead Free: Lead Free; Resistor Type: Thick Film; Weight: 7.1E-05oz; Resistance Tolerance: 1%; Number of Terminations: 2; Min Operating Temperature: -55°C; Depth: 0.8mm; Max Power Dissipation: 100mW; Length: 1.6mm; Case Code (Imperial): 0603; Max Operating Temperature: 155°C; Series: ERJ; Radiation Hardening: No; Features: Automotive AEC-Q200; Mount: Surface Mount; Package Quantity: 1; Packaging: Tape and Reel; Height: 0.45mm; Width: 0.031inch; RoHS Compliant: Yes; Case/Package: 0603; Tolerance: 1%; Contact Plating: Tin; Technology: THICK FILM; Construction: Rectangular; Case Code (Metric): 1608; Termination: SMD/SMT
R8-R10 = CMP-2000-00318-1: Part Number: ERJ-3EKF2002V; Manufacturer: Panasonic
R_SCL R_SDA = CMP-2000-00179-1: Manufacturer: Panasonic; Part Number: ERJ-3EKF1000V
U1 = CMP-0395-00503-2: Single Output LDO, 1 A, Fixed 3.3 V Output, 2 to 5.5 V Input, 4-pin SOT-223 (DCY), -40 to 125 degC, Green (RoHS & no Sb/Br); Manufacturer: Texas Instruments; Vout Adj(Min)(V): 3.3; Vdo(Typ)(mV): 1200; Iq(Typ)(mA): 0.05; Accuracy(%): 2; Iout(Max)(A): 1; SubFamily: Single Channel LDO; Vin(Max)(V): 5.5; PackageReference: DCY0004A; PackageDescription: 4-Pin Plastic Small Outline, Body 3.5 x 6.5 mm, Pitch 2.3 mm; Vout Adj(Max)(V): 3.3; Mounting Technology: Surface Mount; ComponentLink2Description: Datasheet; ComponentLink1Description: Manufacturer URL; PartNumber: TLV1117LV33DCYR; ComponentLink3Description: Package Specification; ComponentLink1URL: http://www.ti.com/; ComponentLink2URL: http://www.ti.com/general/docs/lit/getliterature.tsp?genericPartNumber=TLV1117LV33&fileType=pdf; Fixed Output Options(V): 3.3; PackageVersion: 4202506/B; Vin(Min)(V): 2; DatasheetVersion: SBVS160A; Eco-Plan: Green (RoHS & no Sb/Br); ComponentLink3URL: http://www.ti.com/litv/pdf/mpds094a; Code_JEDEC: TO-261
U2 = CMP-04899-000039-1: IC LOGIC BUFFER/DRIVER
U3 = CMP-06298-000030-1: IC USB TO I2C BRIDGE DEVICE 14SO; Data Rate: 12Mbps; Number of Ports: 1; ESD Protection: Yes; Operating Supply Current: 13mA; Max Supply Voltage: 5.5V; Min Supply Voltage: 3V; Weight: 0.011923oz; Length: 8.65mm; Packaging: Rail/Tube; Radiation Hardening: No; Min Operating Temperature: -40°C; Interface: I2C; Height: 1.5mm; Width: 3.9mm; Package Quantity: 57; Number of Pins: 14; Number of Drivers: 1; REACH SVHC: No SVHC; Case/Package: SOIC; Series: -; RoHS Compliant: Yes; Number of Receivers: 1; Number of Transceivers: 1; Max Operating Temperature: 85°C; Mount: Surface Mount; Lead Free: Lead Free
U4 = CMP-04899-000104-1: DUAL-BIT, 2-DIR PIN DUAL-SUPPLY
U5 = TPS7A5701RTER: No Description Available; Mfr_Name: Texas Instruments; RefDes: RefDes; Type: Type; Supplier 1: Mouser; Supplier Part Number 1: 595-TPS7A5701RTER
U_LS1 U_LS2 = CMP-0859-00123-4: IC BUF NON-INVERT 5.5V SOT23-5; Low Level Output Current: 8mA; Polarity: Non-Inverting; Number of Channels: 1; Propagation Delay: 15.5ns; High Level Output Current: -8mA; Quiescent Current: 1uA; Logic Function: Buffer; Min Supply Voltage: 1.6V; Min Operating Temperature: -40°C; Package Quantity: 3000; Max Operating Temperature: 125°C; Operating Supply Current: 8mA; Radiation Hardening: No; REACH SVHC: No SVHC; Number of Bits per Element: 1; Mount: Surface Mount; Number of Outputs: 1; Lead Free: Lead Free; Number of Pins: 5; Weight: 0.000353oz; Number of Output Lines: 1; Number of Elements: 1; Number of Input Lines: 1; Number of Bits: 1; Case/Package: SOT-23-5; Packaging: Tape and Reel; Max Supply Voltage: 5.5V; Number of Inputs: 1